# Altium project DE-290817.PrjPcb
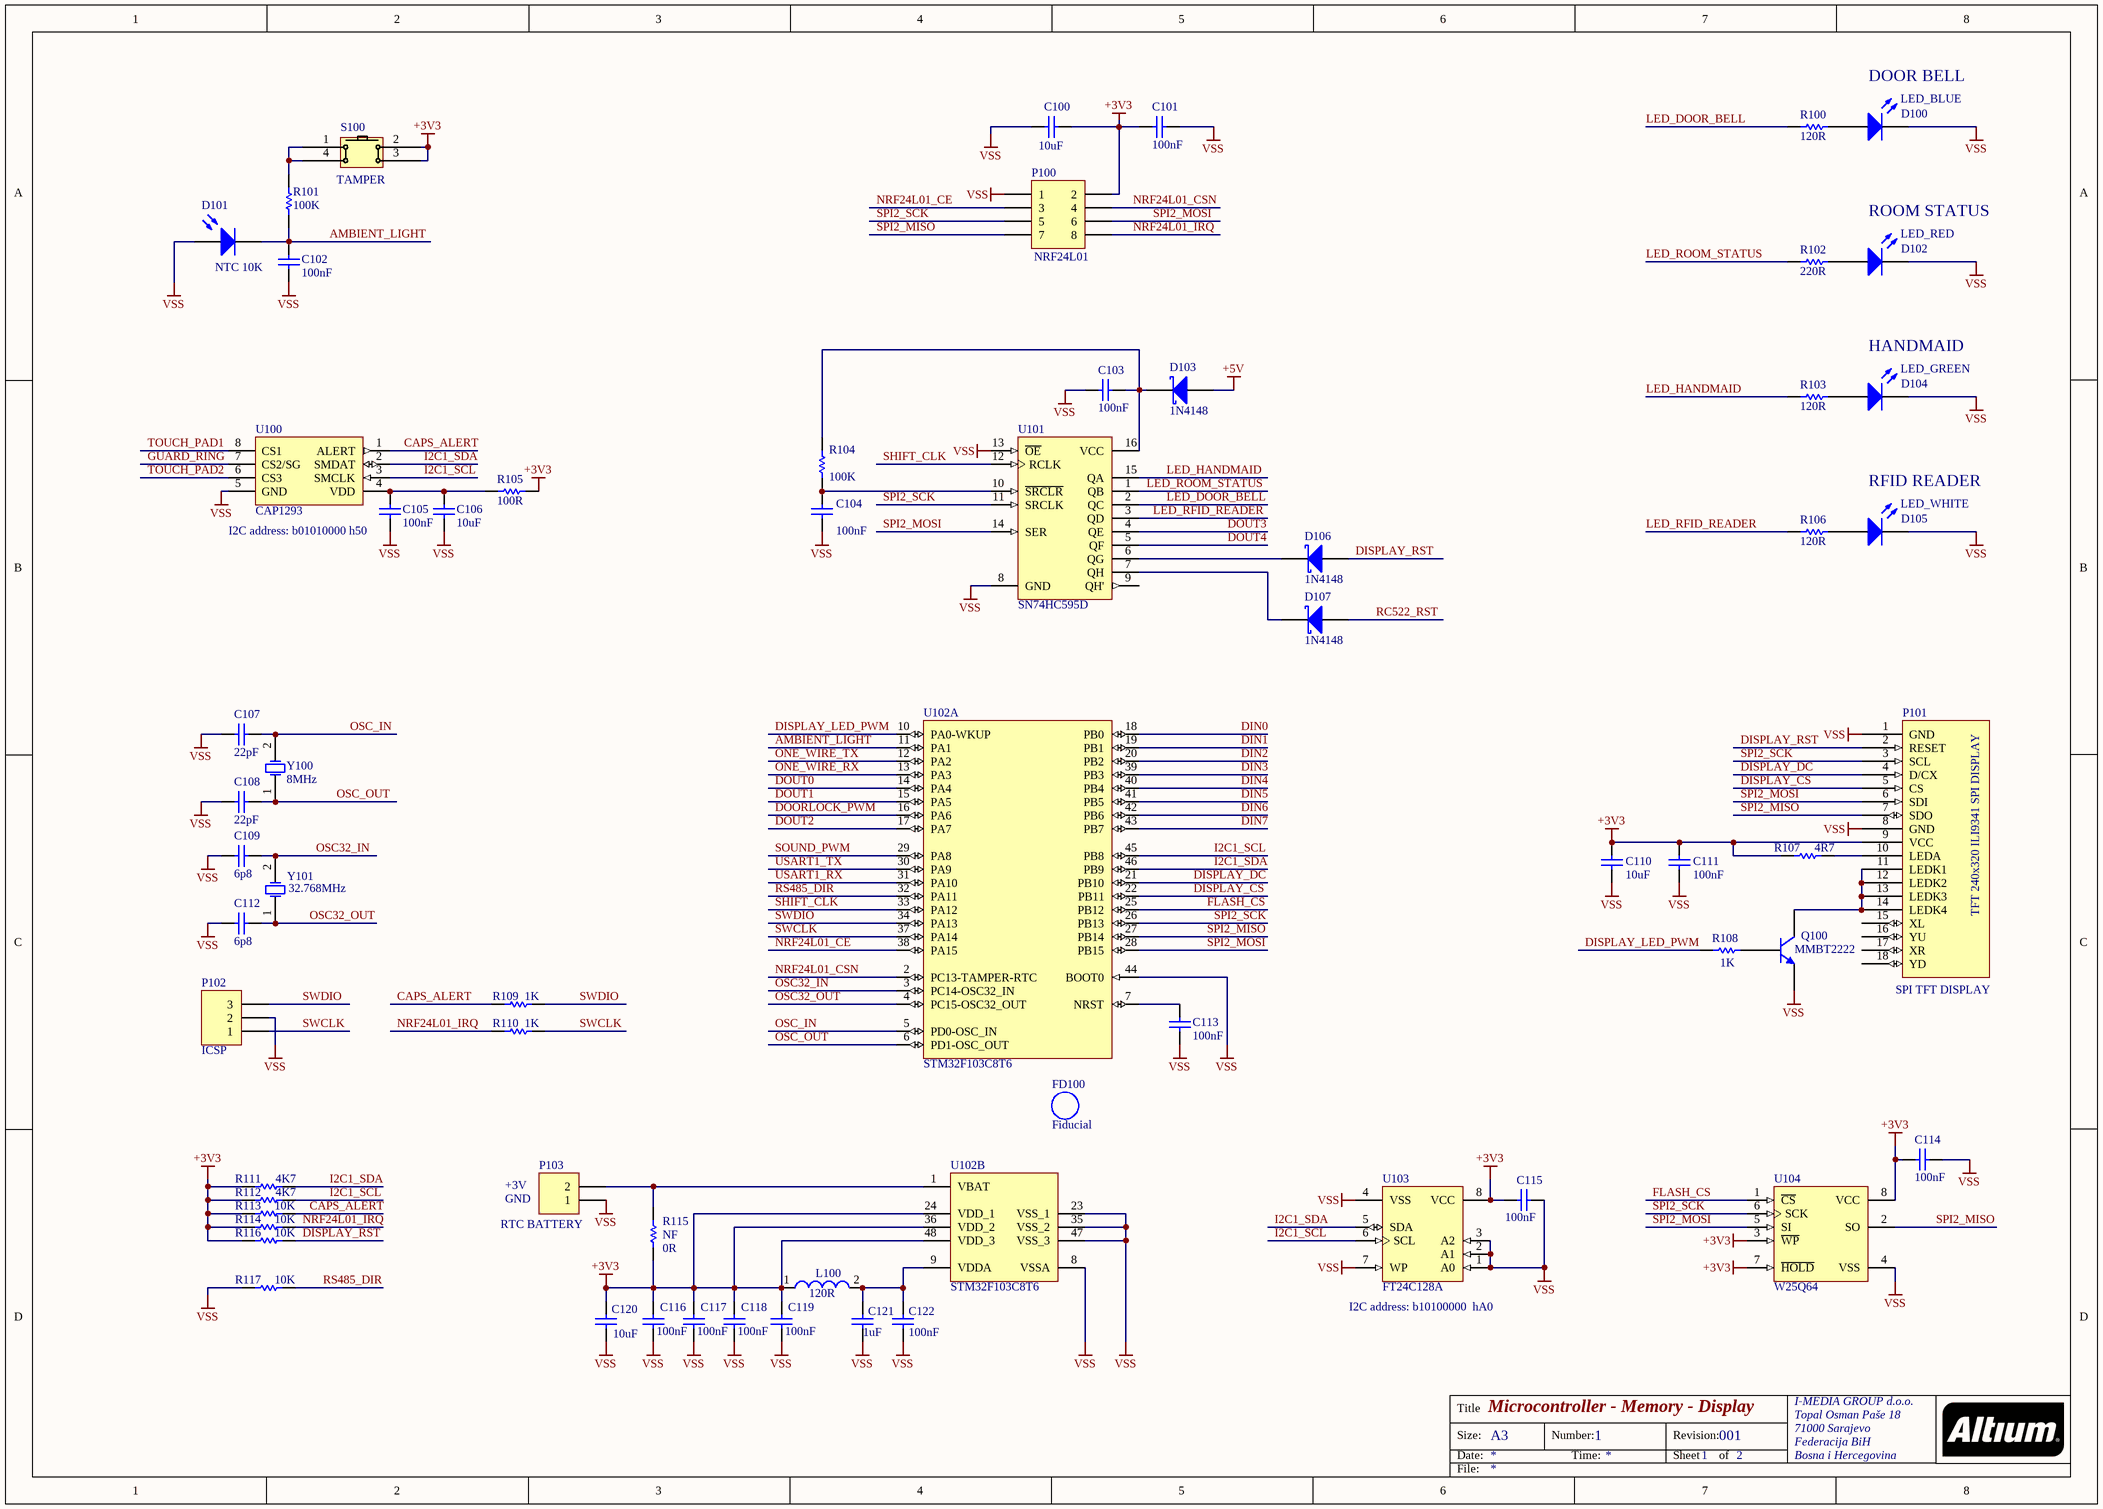
[diagram p0: DE-290817_01.SchDoc]
3 sheets, 176 parts. Net scope: global (net labels, ports and power ports of the same name join across sheets).
Board file: DE-290817.PcbDoc
Sheets:
  DE-290817_01.SchDoc
  DE-290817_02.SchDoc
  DE-290817_03.SchDoc

## Sheet DE-290817_01.SchDoc: Microcontroller - Memory - Display
size A3; Author: eldar6776@hotmail.com; DrawnBy: Eldar Dedić; Organization: I-MEDIA GROUP d.o.o.; Address1: Topal Osman Paše 18; Address2: 71000 Sarajevo; Address3: Federacija BiH; Address4: Bosna i Hercegovina; DocumentNumber: 1; Revision: 001; SheetNumber: 1; SheetTotal: 2; DocumentName: DE-290817; ProjectName: Hotel Room Access Controller Unit

### Parts
C100  10uF  [0805]
C101  100nF  [0603]
C102  100nF  [0603]
C103  100nF  [0603]
C104  100nF  [0603]
C105  100nF  [0603]
C106  10uF  [0805]
C107  22pF  [0603]
C108  22pF  [0603]
C109  6p8  [0603]
C110  10uF  [0805]
C111  100nF  [0603]
C112  6p8  [0603]
C113  100nF  [0603]
C114  100nF  [0603]
C115  100nF  [0603]
C116  100nF  [0603]
C117  100nF  [0603]
C118  100nF  [0603]
C119  100nF  [0603]
C120  10uF  [0805]
C121  1uF  [0603]
C122  100nF  [0603]
D100  LED_BLUE  [1.6X0.8X0.8]
D101  NTC 10K  [PIN2]
D102  LED_RED  [1.6X0.8X0.8]
D103  1N4148  [SOD323]
D104  LED_GREEN  [1.6X0.8X0.8]
D105  LED_WHITE  [1.6X0.8X0.8]
D106  1N4148  [SOD323]
D107  1N4148  [SOD323]
FD100  Fiducial  [Fiducial]  (no BOM)
L100  120R  [SMD-0805]
P100  NRF24L01  [HDR2X4]
P101  SPI TFT DISPLAY  [DISPLAY CON]
P102  ICSP  [ICSP]
P103  RTC BATTERY  [HDR1X2]
Q100  MMBT2222  [SOT23_N]
R100  120R  [ERA-0603]
R101  100K  [ERA-0603]
R102  220R  [ERA-0603]
R103  120R  [ERA-0603]
R104  100K  [ERA-0603]
R105  100R  [ERA-0603]
R106  120R  [ERA-0603]
R107  4R7  [ERA-0603]
R108  1K  [ERA-0603]
R109  1K  [ERA-0603]
R110  1K  [ERA-0603]
R111  4K7  [ERA-0603]
R112  4K7  [ERA-0603]
R113  10K  [ERA-0603]
R114  10K  [ERA-0603]
R115  NF  value 0R  [ERA-0603]
R116  10K  [ERA-0603]
R117  10K  [ERA-0603]
S100  TAMPER  [TACTILE_SWITCH]
U100  CAP1293  [SOP8]
U101  SN74HC595D  [D016_N]
U102  STM32F103C8T6  [STM-LQFP48_N]  (parts A,B of 2)
U103  FT24C128A  [SOIC-SN8_N]
U104  W25Q64  [SOIJ-SM8_N]
Y100  8MHz  [HC49/4H_SMX]
Y101  32.768MHz  [R26]

### Nets
+3V3: C100.1 C101.1 C110.2 C111.1 C114.1 C115.1 C116.2 C117.2 C118.2 C119.2 C120.2 L100.1 P100.2 P101.9(VCC) R105.2 R107.1 R111.2 R112.2 R113.2 R114.2 R115.2 R116.2 S100.2 S100.3 U102.24(VDD_1) U102.36(VDD_2) U102.48(VDD_3) U103.8(VCC) U104.3(~{WP}) U104.7(~{HOLD}) U104.8(VCC)
+5V: D103.2(A)
VSS: C100.2 C101.2 C102.1 C103.2 C104.1 C105.2 C106.1 C107.2 C108.2 C109.2 C110.1 C111.2 C112.2 C113.2 C114.2 C115.2 C116.1 C117.1 C118.1 C119.1 C120.1 C121.1 C122.1 D100.2(K) D101.1(A) D102.2(K) D104.2(K) D105.2(K) P100.1 P101.1(GND) P101.8(GND) P102.2 P103.1 Q100.2(E) R117.2 U100.5(GND) U101.8(GND) U101.13(~{OE}) U102.8(VSSA) U102.23(VSS_1) U102.35(VSS_2) U102.44(BOOT0) U102.47(VSS_3) U103.1(A0) U103.2(A1) U103.3(A2) U103.4(VSS) U103.7(WP) U104.4(VSS)
AMBIENT_LIGHT: C102.2 D101.2(K) R101.2 U102.11(PA1)
CAPS_ALERT: R109.2 R113.1 U100.1(ALERT)
DIN0: U102.18(PB0)
DIN1: U102.19(PB1)
DIN2: U102.20(PB2)
DIN3: U102.39(PB3)
DIN4: U102.40(PB4)
DIN5: U102.41(PB5)
DIN6: U102.42(PB6)
DIN7: U102.43(PB7)
DISPLAY_CS: P101.5(CS) U102.22(PB11)
DISPLAY_DC: P101.4(D/CX) U102.21(PB10)
DISPLAY_LED_PWM: R108.1 U102.10(PA0-WKUP)
DISPLAY_RST: D106.2(A) P101.2(RESET) R116.1
DOORLOCK_PWM: U102.16(PA6)
DOUT0: U102.14(PA4)
DOUT1: U102.15(PA5)
DOUT2: U102.17(PA7)
DOUT3: U101.4(QE)
DOUT4: U101.5(QF)
FLASH_CS: U102.25(PB12) U104.1(~{CS})
GUARD_RING: U100.7(CS2/SG)
I2C1_SCL: R112.1 U100.3(SMCLK) U102.45(PB8) U103.6(SCL)
I2C1_SDA: R111.1 U100.2(SMDAT) U102.46(PB9) U103.5(SDA)
LED_DOOR_BELL: R100.2 U101.2(QC)
LED_HANDMAID: R103.2 U101.15(QA)
LED_RFID_READER: R106.2 U101.3(QD)
LED_ROOM_STATUS: R102.2 U101.1(QB)
NRF24L01_CE: P100.3 U102.38(PA15)
NRF24L01_CSN: P100.4 U102.2(PC13-TAMPER-RTC)
NRF24L01_IRQ: P100.8 R110.2 R114.1
ONE_WIRE_RX: U102.13(PA3)
ONE_WIRE_TX: U102.12(PA2)
OSC32_IN: C109.1 U102.3(PC14-OSC32_IN) Y101.2(OSC2)
OSC32_OUT: C112.1 U102.4(PC15-OSC32_OUT) Y101.1(OSC1)
OSC_IN: C107.1 U102.5(PD0-OSC_IN) Y100.2(OSC2)
OSC_OUT: C108.1 U102.6(PD1-OSC_OUT) Y100.1(OSC1)
RC522_RST: D107.2(A)
RS485_DIR: R117.1 U102.32(PA11)
SHIFT_CLK: U101.12(RCLK) U102.33(PA12)
SOUND_PWM: U102.29(PA8)
SPI2_MISO: P100.7 P101.7(SDO) U102.27(PB14) U104.2(SO)
SPI2_MOSI: P100.6 P101.6(SDI) U101.14(SER) U102.28(PB15) U104.5(SI)
SPI2_SCK: P100.5 P101.3(SCL) U101.11(SRCLK) U102.26(PB13) U104.6(SCK)
SWCLK: P102.1 R110.1 U102.37(PA14)
SWDIO: P102.3 R109.1 U102.34(PA13)
TOUCH_PAD1: U100.8(CS1)
TOUCH_PAD2: U100.6(CS3)
USART1_RX: U102.31(PA10)
USART1_TX: U102.30(PA9)
NetC103_1: C103.1 D103.1(K) R104.1 U101.16(VCC)
NetC104_2: C104.2 R104.2 U101.10(~{SRCLR})
NetC105_1: C105.1 C106.2 R105.1 U100.4(VDD)
NetC113_1: C113.1 U102.7(NRST)
NetC121_2: C121.2 C122.2 L100.2 U102.9(VDDA)
NetD100_1: D100.1(A) R100.1
NetD102_1: D102.1(A) R102.1
NetD104_1: D104.1(A) R103.1
NetD105_1: D105.1(A) R106.1
NetD106_1: D106.1(K) U101.6(QG)
NetD107_1: D107.1(K) U101.7(QH)
NetP101_10: P101.10(LEDA) R107.2
NetP101_11: P101.11(LEDK1) P101.12(LEDK2) P101.13(LEDK3) P101.14(LEDK4) Q100.3(C)
NetP103_2: P103.2 R115.1 U102.1(VBAT)
NetQ100_1: Q100.1(B) R108.2
NetR101_1: R101.1 S100.1 S100.4

Not connected (* = marked no-connect by the designer): P101 15(XL) 16(YU) 17(XR) 18(YD); U101 9(QH')

### Notes on the sheet
- DOOR BELL
- ROOM STATUS
- HANDMAID
- RFID READER
- (near C105) I2C address: b01010000 h50
- +3V
- GND
- (near U103) I2C address: b10100000  hA0
- Title
- Size:
- Date:
- A3
- Number:
- Time:
- Revision:
- Sheet
- of
- File:
- (in symbol DISPLAY CONNECTOR) TFT 240x320 ILI9341 SPI DISPLAY

### Library data of the parts
C100 C106 C110 C120 = C0805: Ceramic Chip Capacitor - Standard; Note: Footprint corresponds to dimensions for bulk cassette packaging. This case size has tightened tolerances.; Published: 17-Jul-2002; LatestRevisionDate: 19-Mar-2004; LatestRevisionNote: Silkscreen size reduced.; DatasheetDocument: Mar-2001; PackageDocument: Mar-2001; PackageReference: 0805; Publisher: Altium Limited; Code_JEITA: 0805; Code_IPC: 2012[0805]; ComponentLink1Description: Manufacturer Link; ComponentLink1URL: http://www.kemet.com/; ComponentLink2Description: Datasheet; ComponentLink2URL: http://www.kemet.com/kemet/web/homepage/kechome.nsf/vapubfilesname/F3102TA.pdf/$file/F3102TA.pdf; Value: 10uF
C101 C102 C104 C105 C107-C109 C111-C119 C121 C122 = C0603: Ceramic Chip Capacitor - Standard; Note: Footprint corresponds to dimensions for bulk cassette packaging. This case size has tightened tolerances.; Published: 17-Jul-2002; LatestRevisionDate: 19-Mar-2004; LatestRevisionNote: Silkscreen size reduced.; DatasheetDocument: Mar-2001; PackageDocument: Mar-2001; PackageReference: 0603; Publisher: Altium Limited; Code_JEITA: 0603; Code_IPC: 1608 [0603]; ComponentLink1Description: Manufacturer Link; ComponentLink1URL: http://www.kemet.com/; ComponentLink2Description: Datasheet; ComponentLink2URL: http://www.kemet.com/kemet/web/homepage/kechome.nsf/vapubfilesname/F3102TA.pdf/$file/F3102TA.pdf
  C104 C105 C111 C113 C115 C122: Value: 100nF
  C121: Value: 1uF
C103 = C0603: Ceramic Chip Capacitor - Standard; Note: Footprint corresponds to dimensions for bulk cassette packaging. This case size has tightened tolerances.; Value: 1uF; Published: 17-Jul-2002; LatestRevisionDate: 19-Mar-2004; LatestRevisionNote: Silkscreen size reduced.; DatasheetDocument: Mar-2001; PackageDocument: Mar-2001; PackageReference: 0603; Publisher: Altium Limited; Code_JEITA: 0603; Code_IPC: 1608 [0603]; ComponentLink1Description: Manufacturer Link; ComponentLink1URL: http://www.kemet.com/; ComponentLink2Description: Datasheet; ComponentLink2URL: http://www.kemet.com/kemet/web/homepage/kechome.nsf/vapubfilesname/F3102TA.pdf/$file/F3102TA.pdf
D100 D102 D104 D105 = HSMZ-C190: High Performance Chip LED, Red; LuminousIntensity: 40mcd (Minimum).; PCB_Layout: Complies with manufacturer's recommendation.; Published: 11-Dec-2002; DatasheetDocument: 11-Mar-2002; PackageDocument: 11-Mar-2002; PackageReference: 1.6X0.8X0.8; Publisher: Altium Limited; LED_Colour: Red; ComponentLink1Description: Manufacturer Link; ComponentLink1URL: http://www.agilent.com/; ComponentLink2Description: Datasheet; ComponentLink2URL: http://cp.literature.agilent.com/litweb/pdf/5988-5891EN.pdf
D101 = Photo Sen: Photosensitive Diode; Published: 24-Mar-1999; LatestRevisionDate: 17-Jul-2002; LatestRevisionNote: Re-released for DXP Platform.; PackageReference: PIN2; Publisher: Altium Limited
D103 D106 D107 = 1PS76SB10: Schottky Barrier Diode; Published: 17-Sep-2003; LatestRevisionDate: 19-Mar-2004; LatestRevisionNote: Silkscreen size reduced.; DatasheetVersion: 14-Oct-1996; PackageVersion: May-1999; PackageReference: SOD323; Publisher: Altium Limited; PackageDescription: SOD-323/SC-76; 2 Leads; Body 1.7 x 1.3 mm, (LxW); ComponentLink1Description: Manufacturer Link; ComponentLink1URL: http://www.semiconductors.philips.com/; ComponentLink2Description: Datasheet; ComponentLink2URL: http://www.semiconductors.philips.com/acrobat/datasheets/1PS76SB10_2.pdf
FD100 = Fiduchial: Fiduchial mark
L100 = 74279202: SMD EMI Suppression Ferrite Bead WE-CBF, Z = 120 Ohm; Impedance: 120 Ohm; DatasheetVersion: Dec-2005; PackageVersion: 2005; PackageReference: SMD-0805; PackageDescription: Chip Inductor, 2-Leads, Body 2.0 x 1.2 mm; ComponentLink1Description: Manufacturer URL; ComponentLink1URL: http://www.we-online.com; ComponentLink2Description: Datasheet; ComponentLink2URL: http://www.we-online.de/katalog/media/pdf/74279202.pdf
P100 = Header 4X2: Header, 4-Pin, Dual row; LatestRevisionDate: 17-Jul-2002; LatestRevisionNote: Re-released for DXP Platform.; Publisher: Altium Limited
P101 = DISPLAY CONNECTOR: DISPLAY ILI9341 240x320  CONNECTOR
P102 = ICSP: ICSP connection pads
P103 = Header 2: Header, 2-Pin; LatestRevisionDate: 17-Jul-2002; LatestRevisionNote: Re-released for DXP Platform.; Publisher: Altium Limited
Q100 = BC817: NPN General-purpose Transistor; Published: 17-Sep-2003; LatestRevisionDate: 12-Dec-2006; LatestRevisionNote: IPC-7351 Footprint Added.; DatasheetVersion: Jun-1999; PackageVersion: May-1999; PackageReference: SOT23; Publisher: Altium Limited; PackageDescription: 3-Pin SOT-23 Package 0.95 mm Pitch, 2.3 mm Lead Span; ComponentLink1Description: Manufacturer Link; ComponentLink1URL: http://www.semiconductors.philips.com/; ComponentLink2Description: Datasheet; ComponentLink2URL: http://www.semiconductors.philips.com/acrobat/datasheets/BC817_BC817W_BC337_5.pdf
R100-R117 = ERAV: Metal Film Thermosensitive Chip Resistor, 0.56 Ohm to 10k Ohm Range, 5% Tolerance, 0603 Size, 0.063 W; Note: If flow soldering, adjust pad width of PCB Footprint to 0.7 - 0.8 times the width of the resistor.; Published: 17-Dec-2003; LatestRevisionDate: 19-Mar-2004; LatestRevisionNote: Silkscreen size reduced.; PackageDocument: Mar-2003; PackageReference: ERA-0603; Publisher: Altium Limited; Code_IPC: 1608 [0603]; ComponentLink1Description: Manufacturer Link; ComponentLink1URL: http://www.panasonic.com/industrial/components/resistive_products.htm; ComponentLink2Description: Datasheet; ComponentLink2URL: http://www.panasonic.com/industrial/components/pdf/AOF0000CE1.pdf
  R104: Value: 100K
  R105: Value: 100R
S100 = TACKTILE_SWITCH
U100 = CAP1293: 3-Channel Capacitive Touch Sensor with Proximity Detection & Signal Guard
U101 = SN74HC595D: 8-Bit Shift Register with 3-State Output Registers; Published: 8-Jun-2000; LatestRevisionDate: 13-Apr-2006; LatestRevisionNote: IPC-7351 Footprint Added.; DatasheetVersion: May-1997; PackageVersion: Jan-1998; PackageReference: D016; Publisher: Altium Limited; PackageDescription: 16-Pin Small Outline Integrated Circuit 1.27 mm Pitch; Code_IPC: SOIC127P600-16; ComponentLink1Description: Manufacturer Link; ComponentLink1URL: http://www.ti.com/; ComponentLink2Description: Datasheet; ComponentLink2URL: http://www-s.ti.com/sc/ds/sn74hc595.pdf
U102 = STM32F103C8T6: ARM Cortex-M3 32-bit MCU, 64 KB Flash, 20 KB Internal RAM, 37 I/Os, 48-pin LQFP, -40 to 85 degC, Tray; A/D Converter: 2x12-bit (10 Channel); FLASH Size (Prog) (kB): 64; I/Os (High Current): 37; Internal RAM Size (kB): 20; Operating Frequency(F) (Processor speed) (MHz): 72; Supply Voltage(Vcc) min (V): 2; DatasheetVersion: Rev. 16; PackageVersion: Rev. 6, 06/2013; PackageReference: LQFP48; PackageDescription: 48-Pin Low Profile Quad Flat Package, 7 x 7 mm Body, 0.5 mm Pitch; Supplier 1: Digi-Key; Supplier Part Number 1: 497-6063-ND; Supplier 2: Farnell; Supplier Part Number 2: 1447637; Supplier 3: Newark; Supplier Part Number 3: 59M2182; Supplier 4: Newark; Supplier Part Number 4: 57P1222; Supplier 5: Mouser; Supplier Part Number 5: 511-STM32F103C8T6; Core: ARM Cortex-M3; Packing: Tray; Mounting Technology: Surface Mount; PartNumber: STM32F103C8T6; ComponentLink1Description: Manufacturer URL; ComponentLink1URL: http://www.st.com/web/en/home.html; ComponentLink2Description: Datasheet; ComponentLink2URL: http://www.st.com/st-web-ui/static/active/en/resource/technical/document/datasheet/CD00161566.pdf; ComponentLink3Description: Package Specification; ComponentLink3URL: http://www.st.com/st-web-ui/static/active/en/resource/technical/document/datasheet/DM00058181.pdf
U103 = 24AA64/SN: 64Kbit, 400kHz, 1.7V, I2C Serial EEPROM, 8-Pin SOIC 150mil, Commercial Temperature; Published: 29-Jan-2009; DatasheetVersion: revQ, Jun-2009; PackageVersion: revBB, Aug-2009; PackageReference: SOIC-SN8; Publisher: Altium Limited; PackageDescription: 8-Lead Plastic Small Outline (SN) - Narrow, 3.90mm Body [SOIC]; Supplier 1: Digi-Key; Supplier Part Number 1: 24AA64/SN-ND; Code_JEDEC: MS-012; Code_IPC: SOIC127P600-8; ComponentLink1Description: Datasheet; ComponentLink1URL: http://ww1.microchip.com/downloads/en/DeviceDoc/21189Q.pdf; ComponentLink2Description: Packaging Specification; ComponentLink2URL: http://www.microchip.com/stellent/groups/techpub_sg/documents/packagingspec/en012702.pdf; ComponentLink3Description: Microchip.com Home; ComponentLink3URL: http://www.microchip.com/
U104 = 25LC640A-I/SN: 64K SPI Bus Serial EEPROM, 8-Pin SOIC, Industrial Temperature; Published: 29-Jan-2009; LatestRevisionDate: 02-Dec-2009; LatestRevisionNote: Updated to datasheet revision D, Jan-2008; DatasheetVersion: revD, Oct-2008; PackageVersion: revBB, Aug-2009; PackageReference: SOIC-SN8; Publisher: Altium Limited; PackageDescription: 8-Lead Plastic Small Outline (SN) - Narrow, 3.90mm Body [SOIC]; Supplier 1: Digi-Key; Supplier Part Number 1: 25LC640A-I/SN-ND; Supplier 2: Farnell; Supplier Part Number 2: 1556155; Code_JEDEC: MS-012; Code_IPC: SOIC127P600-8; ComponentLink1Description: Datasheet; ComponentLink1URL: http://ww1.microchip.com/downloads/en/DeviceDoc/21830D.pdf; ComponentLink2Description: Packaging Specification; ComponentLink2URL: http://www.microchip.com/stellent/groups/techpub_sg/documents/packagingspec/en012702.pdf; ComponentLink3Description: Microchip.com Home; ComponentLink3URL: http://www.microchip.com/
Y100 = HC49/4H_SMX: Surface Mount Quartz Crystal; Note: PCB layout complies with manufacturer's recommendation.; Published: 17-Jul-2002; DatasheetDocument: 18-Oct-1999; PackageDocument: 18-Oct-1999; PackageReference: HC49/4H_SMX; Publisher: Altium Limited; ComponentLink1Description: Manufacturer Link; ComponentLink1URL: http://www.cmac.com/mt/; ComponentLink2Description: Datasheet; ComponentLink2URL: http://www.cmac.com/mt/databook/crystals/smd/hc49_4h_smx.pdf
Y101 = R26-32.768: Tuning Fork Crystal Unit; Published: 8-Jun-2000; LatestRevisionDate: 17-Jul-2002; LatestRevisionNote: Re-released for DXP Platform.; DatasheetDocument: 28-Sep-1998; PackageReference: R26; Publisher: Altium Limited; ComponentLink1Description: Manufacturer Link; ComponentLink1URL: http://www.raltron.com/products/microcrystals/default.asp; ComponentLink2Description: Datasheet; ComponentLink2URL: http://www.raltron.com/products/pdfspecs/crystal_r38_26_145.pdf

## Sheet DE-290817_02.SchDoc: Digital I/O - Power - Com
size A3; Author: eldar6776@hotmail.com; DrawnBy: Eldar Dedić; Organization: I-MEDIA GROUP d.o.o.; Address1: Topal Osman Paše 18; Address2: 71000 Sarajevo; Address3: Federacija BiH; Address4: Bosna i Hercegovina; DocumentNumber: 2; Revision: 001; SheetNumber: 2; SheetTotal: 2; DocumentName: DE-290817; ProjectName: Hotel Room Access Controller Unit
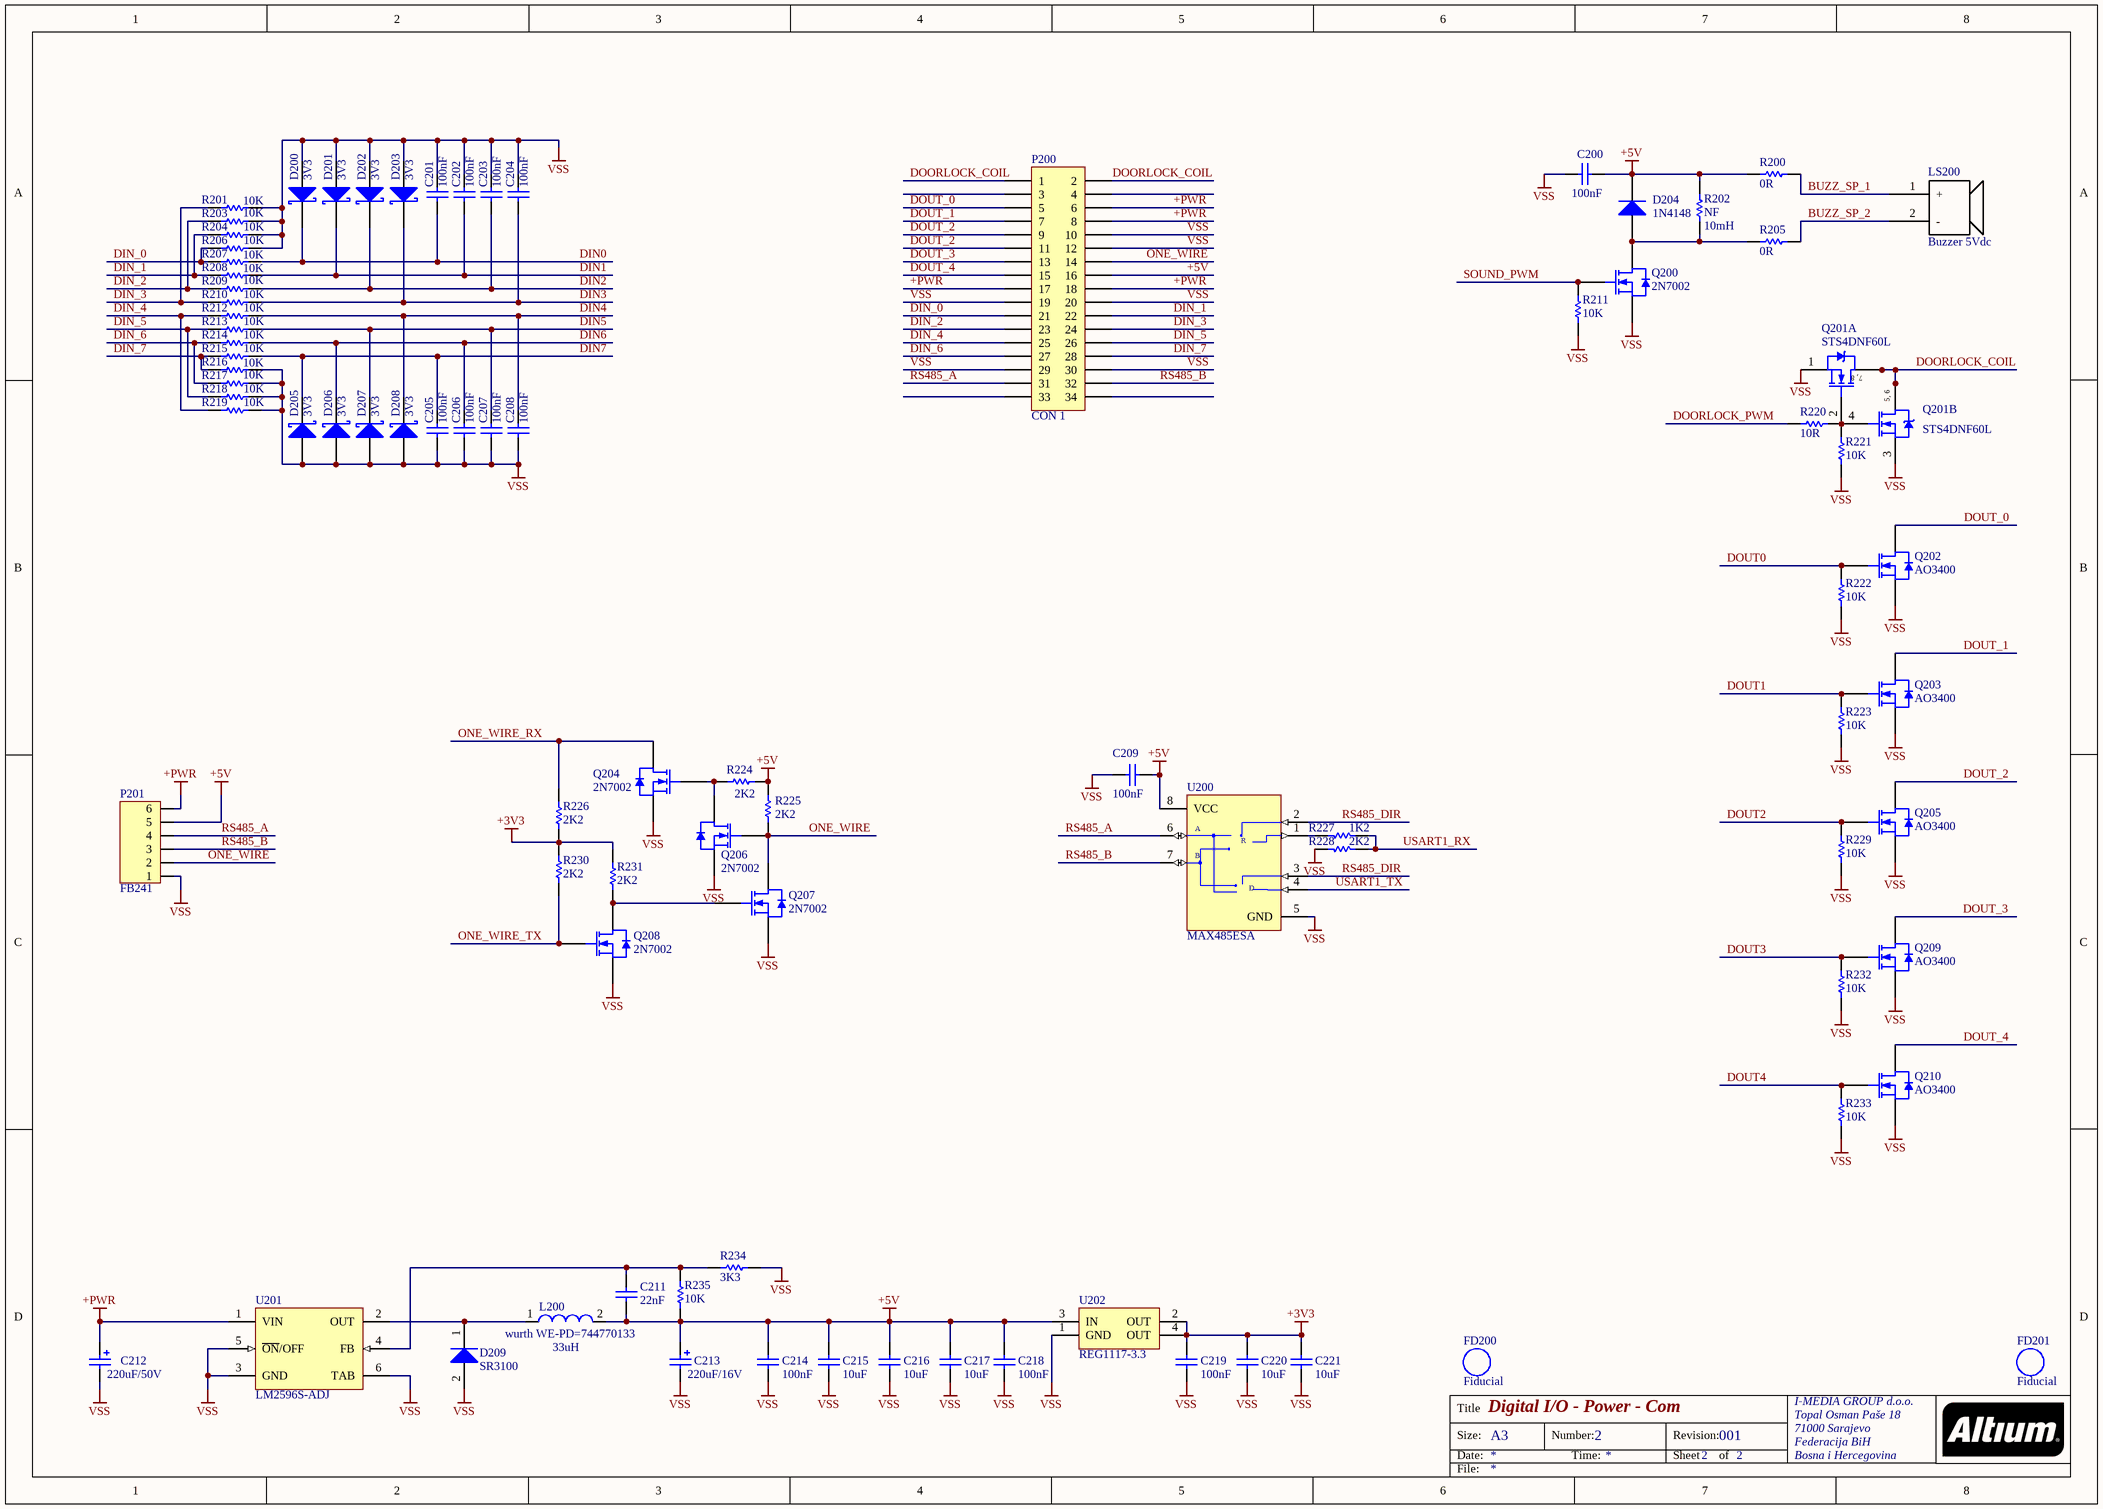
[diagram p1: DE-290817_02.SchDoc]

### Parts
C200  100nF  [0603]
C201  100nF  [0603]
C202  100nF  [0603]
C203  100nF  [0603]
C204  100nF  [0603]
C205  100nF  [0603]
C206  100nF  [0603]
C207  100nF  [0603]
C208  100nF  [0603]
C209  100nF  [0603]
C211  22nF  [0603]
C212  220uF/50V  [EEEHA1H101P]
C213  220uF/16V  [EEEHA1H101P]
C214  100nF  [0603]
C215  10uF  [0805]
C216  10uF  [0805]
C217  10uF  [0805]
C218  100nF  [0603]
C219  100nF  [0603]
C220  10uF  [0805]
C221  10uF  [0805]
D200  3V3  [SOD323]
D201  3V3  [SOD323]
D202  3V3  [SOD323]
D203  3V3  [SOD323]
D204  1N4148  [SOD323]
D205  3V3  [SOD323]
D206  3V3  [SOD323]
D207  3V3  [SOD323]
D208  3V3  [SOD323]
D209  SR3100  [ONSC-SMA-2-403D-02_C_V]
FD200  Fiducial  [Fiducial]  (no BOM)
FD201  Fiducial  [Fiducial]  (no BOM)
L200  wurth WE-PD=744770133  value 33uH  [WE-PD-XL]
LS200  Buzzer 5Vdc  [BUZZER]
P200  CON 1  [HDR2X17]
P201  FB241  [FB241_6]
Q200  2N7002  [SOT23_N]
Q201  STS4DNF60L  [ONSC-SOIC-8-751-07_V]  (parts A,B of 2)
Q202  AO3400  [SOT23_N]
Q203  AO3400  [SOT23_N]
Q204  2N7002  [SOT23_N]
Q205  AO3400  [SOT23_N]
Q206  2N7002  [SOT23_N]
Q207  2N7002  [SOT23_N]
Q208  2N7002  [SOT23_N]
Q209  AO3400  [SOT23_N]
Q210  AO3400  [SOT23_N]
R200  0R  [ERA-0603]
R201  10K  [ERA-0603]
R202  NF  value 10mH  [RD3.2x1.7]
R203  10K  [ERA-0603]
R204  10K  [ERA-0603]
R205  0R  [ERA-0603]
R206  10K  [ERA-0603]
R207  10K  [ERA-0603]
R208  10K  [ERA-0603]
R209  10K  [ERA-0603]
R210  10K  [ERA-0603]
R211  10K  [ERA-0603]
R212  10K  [ERA-0603]
R213  10K  [ERA-0603]
R214  10K  [ERA-0603]
R215  10K  [ERA-0603]
R216  10K  [ERA-0603]
R217  10K  [ERA-0603]
R218  10K  [ERA-0603]
R219  10K  [ERA-0603]
R220  10R  [ERA-0603]
R221  10K  [ERA-0603]
R222  10K  [ERA-0603]
R223  10K  [ERA-0603]
R224  2K2  [ERA-0603]
R225  2K2  [ERA-0603]
R226  2K2  [ERA-0603]
R227  1K2  [ERA-0603]
R228  2K2  [ERA-0603]
R229  10K  [ERA-0603]
R230  2K2  [ERA-0603]
R231  2K2  [ERA-0603]
R232  10K  [ERA-0603]
R233  10K  [ERA-0603]
R234  3K3  [ERA-0603]
R235  10K  [ERA-0603]
U200  MAX485ESA  [NSO8_M]
U201  LM2596S-ADJ  [TS5B_N]
U202  REG1117-3.3  [ZZ311]

### Nets
+3V3: C219.2 C220.2 C221.2 R226.1 R230.2 R231.2 U202.2(OUT) U202.4(OUT)
+5V: C200.1 C209.2 C211.1 C213.1 C214.2 C215.2 C216.2 C217.2 C218.2 D204.1(K) L200.2 P200.16 P201.5 R200.2 R202.2 R224.1 R225.2 R235.2 U200.8(VCC) U202.3(IN)
+PWR: C212.1 P200.6 P200.8 P200.17 P200.18 P201.6 U201.1(VIN)
VSS: C200.2 C201.1 C202.1 C203.1 C204.1 C205.1 C206.1 C207.1 C208.1 C209.1 C212.2 C213.2 C214.1 C215.1 C216.1 C217.1 C218.1 C219.1 C220.1 C221.1 D200.2(A) D201.2(A) D202.2(A) D203.2(A) D205.2(A) D206.2(A) D207.2(A) D208.2(A) D209.2(A) P200.10 P200.12 P200.19 P200.20 P200.29 P200.30 P201.1 Q200.2(S) Q201.1(S1) Q201.3(S2) Q202.2(S) Q203.2(S) Q204.2(S) Q205.2(S) Q206.2(S) Q207.2(S) Q208.2(S) Q209.2(S) Q210.2(S) R201.2 R203.2 R204.2 R206.2 R211.1 R216.2 R217.2 R218.2 R219.2 R221.2 R222.1 R223.1 R228.2 R229.1 R232.1 R233.1 R234.2 U200.5(GND) U201.3(GND) U201.5(~{ON}/OFF) U201.6(TAB) U202.1(GND)
BUZZ_SP_1: LS200.1(+) R200.1
BUZZ_SP_2: LS200.2(-) R205.1
DIN0: C201.2 D200.1(K) R207.2
DIN1: C202.2 D201.1(K) R208.2
DIN2: C203.2 D202.1(K) R209.2
DIN3: C204.2 D203.1(K) R210.2
DIN4: C208.2 D208.1(K) R212.2
DIN5: C207.2 D207.1(K) R213.2
DIN6: C206.2 D206.1(K) R214.2
DIN7: C205.2 D205.1(K) R215.2
DIN_0: P200.21 R206.1 R207.1
DIN_1: P200.22 R204.1 R208.1
DIN_2: P200.23 R203.1 R209.1
DIN_3: P200.24 R201.1 R210.1
DIN_4: P200.25 R212.1 R219.1
DIN_5: P200.26 R213.1 R218.1
DIN_6: P200.27 R214.1 R217.1
DIN_7: P200.28 R215.1 R216.1
DOORLOCK_COIL: P200.1 P200.2 Q201.5(D2) Q201.6(D2) Q201.7(D1) Q201.8(D1)
DOORLOCK_PWM: R220.2
DOUT0: Q202.1(G) R222.2
DOUT1: Q203.1(G) R223.2
DOUT2: Q205.1(G) R229.2
DOUT3: Q209.1(G) R232.2
DOUT4: Q210.1(G) R233.2
DOUT_0: P200.5 Q202.3(D)
DOUT_1: P200.7 Q203.3(D)
DOUT_2: P200.9 P200.11 Q205.3(D)
DOUT_3: P200.13 Q209.3(D)
DOUT_4: P200.15 Q210.3(D)
ONE_WIRE: P200.14 P201.2 Q206.1(G) Q207.3(D) R225.1
ONE_WIRE_RX: Q204.3(D) R226.2
ONE_WIRE_TX: Q208.1(G) R230.1
RS485_A: P200.31 P201.4 U200.6(A)
RS485_B: P200.32 P201.3 U200.7(B)
RS485_DIR: U200.2(~{RE}) U200.3(DE)
SOUND_PWM: Q200.1(G) R211.2
USART1_RX: R227.2 R228.1
USART1_TX: U200.4(DI)
NetC211_2: C211.2 R234.1 R235.1 U201.4(FB)
NetD204_2: D204.2(A) Q200.3(D) R202.1 R205.2
NetD209_1: D209.1(K) L200.1 U201.2(OUT)
NetQ201_2: Q201.2(G1) Q201.4(G2) R220.1 R221.1
NetQ204_1: Q204.1(G) Q206.3(D) R224.2
NetQ207_1: Q207.1(G) Q208.3(D) R231.1
NetR227_1: R227.1 U200.1(RO)

Not connected (* = marked no-connect by the designer): P200 3 4 33 34

### Notes on the sheet
- Title
- Size:
- Date:
- A3
- Number:
- Time:
- Revision:
- Sheet
- of
- File:
- (in symbol MAX485ESA) R; D
- (in symbol NVMD6N04R2G, part A) 7, 8
- (in symbol NVMD6N04R2G, part B) 5, 6

### Library data of the parts
C200-C209 C211 C214 C218 C219 = C0603: as C101 on sheet DE-290817_01; Published: 17-Jul-2002; LatestRevisionDate: 19-Mar-2004; LatestRevisionNote: Silkscreen size reduced.; DatasheetDocument: Mar-2001; PackageDocument: Mar-2001; PackageReference: 0603; Publisher: Altium Limited; Code_JEITA: 0603; Code_IPC: 1608 [0603]; ComponentLink1Description: Manufacturer Link; ComponentLink1URL: http://www.kemet.com/; ComponentLink2Description: Datasheet; ComponentLink2URL: http://www.kemet.com/kemet/web/homepage/kechome.nsf/vapubfilesname/F3102TA.pdf/$file/F3102TA.pdf
  C200-C209 C214 C218 C219: Value: 100nF
  C211: Value: 22nF
C212 = EEEHA1H101P: Aluminum Electrolytic Capacitors (SMD Type); Value: 220uF/50V
C213 = EEEHA1C221P: Aluminum Electrolytic Capacitors (SMD Type); Value: 220uF/16V
C215-C217 C220 C221 = C0805: as C100 on sheet DE-290817_01; Published: 17-Jul-2002; LatestRevisionDate: 19-Mar-2004; LatestRevisionNote: Silkscreen size reduced.; DatasheetDocument: Mar-2001; PackageDocument: Mar-2001; PackageReference: 0805; Publisher: Altium Limited; Code_JEITA: 0805; Code_IPC: 2012[0805]; ComponentLink1Description: Manufacturer Link; ComponentLink1URL: http://www.kemet.com/; ComponentLink2Description: Datasheet; ComponentLink2URL: http://www.kemet.com/kemet/web/homepage/kechome.nsf/vapubfilesname/F3102TA.pdf/$file/F3102TA.pdf; Value: 10uF
D200-D203 D205-D208 = 1PS76SB10: Schottky Barrier Diode; Published: 17-Sep-2003; LatestRevisionDate: 19-Mar-2004; LatestRevisionNote: Silkscreen size reduced.; DatasheetVersion: 14-Oct-1996; PackageVersion: May-1999; PackageReference: SOD323; Publisher: Altium Limited; PackageDescription: SOD-323/SC-76; 2 Leads; Body 1.7 x 1.3 mm, (LxW); ComponentLink1Description: Manufacturer Link; ComponentLink1URL: http://www.semiconductors.philips.com/; ComponentLink2Description: Datasheet; ComponentLink2URL: http://www.semiconductors.philips.com/acrobat/datasheets/1PS76SB10_2.pdf
D204 = BAS321: General-purpose Diode; Published: 17-Sep-2003; LatestRevisionDate: 19-Mar-2004; LatestRevisionNote: Silkscreen size reduced.; DatasheetVersion: 9-Feb-1999; PackageVersion: May-1999; PackageReference: SOD323; Publisher: Altium Limited; PackageDescription: SOD-323/SC-76; 2 Leads; Body 1.7 x 1.3 mm, (LxW); ComponentLink1Description: Manufacturer Link; ComponentLink1URL: http://www.semiconductors.philips.com/; ComponentLink2Description: Datasheet; ComponentLink2URL: http://www.semiconductors.philips.com/acrobat/datasheets/BAS321_2.pdf; Value: 1N4148
D209 = MBRA320T3G: Schottky Power Rectifier, 2-Pin SMA, Pb-Free, Tape and Reel; Manufacturer: On Semiconductor; Configuration: Single; IFSM Max (A): 80; DatasheetVersion: Rev. 0; PackageVersion: Rev. C, 08/2005; PackageReference: SMA-2-403D-02_C; PackageDescription: 2-Pin Small Molded Package, J-Bend Lead, Body 4.315 x 2.605 mm; Supplier 1: Digi-Key; Supplier Part Number 1: MBRA320T3GOSTR-ND; Supplier 2: Digi-Key; Supplier Part Number 2: MBRA320T3GOSCT-ND; Supplier 3: Digi-Key; Supplier Part Number 3: MBRA320T3GOSDKR-ND; Supplier 4: Farnell; Supplier Part Number 4: 2101200; Supplier 5: Newark; Supplier Part Number 5: 95M6589; Supplier 6: Mouser; Supplier Part Number 6: 863-MBRA320T3G; Packing: Tape and Reel; RoHS: TRUE; Mounting Technology: Surface Mount; PartNumber: MBRA320T3G; ComponentLink1Description: Manufacturer URL; ComponentLink1URL: http://www.onsemi.com/; ComponentLink2Description: Datasheet; ComponentLink2URL: http://www.onsemi.cn/pub_link/Collateral/MBRA320-D.PDF; ComponentLink3Description: Package Specification; ComponentLink3URL: http://www.onsemi.com/pub_link/Collateral/MBRA320-D.PDF; Value: SR3100
FD200 FD201 = Fiduchial: Fiduchial mark
L200 = 744770133: SMD-Shielded Power Inductor WE-PD, L = 33 µH; Inductance: 33.0 µH; DatasheetVersion: ver 5, Oct-2004; PackageReference: WE-PD-XL; PackageDescription: SMD Inductor, 2-Leads, Body 12.0 x 12.0 mm; PartNumber: 744770133; ComponentLink1Description: Manufacturer URL; ComponentLink1URL: http://www.we-online.com; ComponentLink2Description: Datasheet; ComponentLink2URL: http://www.we-online.de/katalog/media/pdf/744770133.pdf
LS200 = BUZZER: 5Vdc PCB buzzer
P200 = Header 17X2: Header, 17-Pin, Dual row; LatestRevisionDate: 17-Jul-2002; LatestRevisionNote: Re-released for DXP Platform.; Publisher: Altium Limited
P201 = TERMINAL BLOCK 6: PCB MOUNT TERMINAL BLOCK 2.5MM PITCH
Q200 Q202 Q203 Q205 Q209 Q210 = 2N7002: N-channel Enhancement Mode Field-effect Transistor; Published: 17-Sep-2003; LatestRevisionDate: 12-Dec-2006; LatestRevisionNote: IPC-7351 Footprint Added.; DatasheetVersion: 27-Jul-2000; PackageVersion: May-1999; PackageReference: SOT23; Publisher: Altium Limited; PackageDescription: 3-Pin SOT-23 Package 0.95 mm Pitch, 2.3 mm Lead Span; ComponentLink1Description: Manufacturer Link; ComponentLink1URL: http://www.semiconductors.philips.com/; ComponentLink2Description: Datasheet; ComponentLink2URL: http://www.semiconductors.philips.com/acrobat/datasheets/2N7002_4.pdf
  Q200: Value: 2N7002
Q201 = NVMD6N04R2G: Power MOSFET, 40 V, 5.8 A, Dual N-Channel, 8-Pin SOIC, Pb-Free, Tape and Reel; Manufacturer: On Semiconductor; Channel Polarity: N Channel; Ciss Typ (pF): 723; Coss Typ (pF): 156; Crss Typ (pF): 53; ID Max (A): 5.8; Qrr Typ (nC): 20; V(BR)DSS Min (V): 40; VGS(th) Max (V): 3; DatasheetVersion: Rev. 2; PackageVersion: Rev. AK, 02/2011; PackageReference: SOIC-8-751-07; PackageDescription: 8-Pin Small Outline Integrated Circuit, Body 4.9 x 3.9 mm, Pitch 1.27 mm; Configuration: Dual; Package Type: SOIC-8; Packing: Tape and Reel; RoHS: Pb-Free; VGS Max (V): 20; Mounting Technology: Surface Mount; PartNumber: NVMD6N04R2G; ComponentLink1Description: Manufacturer URL; ComponentLink1URL: http://www.onsemi.com/; ComponentLink2Description: Datasheet; ComponentLink2URL: http://www.onsemi.com/pub_link/Collateral/NTMD6N04R2-D.PDF; ComponentLink3Description: Package Specification; ComponentLink3URL: http://www.onsemi.com/pub_link/Collateral/751-07.PDF
Q204 Q206-Q208 = BSS123: N-channel Enhancement Mode Vertical D-MOSFET; Published: 17-Sep-2003; LatestRevisionDate: 12-Dec-2006; LatestRevisionNote: IPC-7351 Footprint Added.; DatasheetVersion: Apr-1995; PackageVersion: May-1999; PackageReference: SOT23; Publisher: Altium Limited; PackageDescription: 3-Pin SOT-23 Package 0.95 mm Pitch, 2.3 mm Lead Span; ComponentLink1Description: Manufacturer Link; ComponentLink1URL: http://www.semiconductors.philips.com/; ComponentLink2Description: Datasheet; ComponentLink2URL: http://www.semiconductors.philips.com/acrobat/datasheets/BSS123_3.pdf
R200 R201 R203-R235 = ERAV: as R100 on sheet DE-290817_01; Published: 17-Dec-2003; LatestRevisionDate: 19-Mar-2004; LatestRevisionNote: Silkscreen size reduced.; PackageDocument: Mar-2003; PackageReference: ERA-0603; Publisher: Altium Limited; Code_IPC: 1608 [0603]; ComponentLink1Description: Manufacturer Link; ComponentLink1URL: http://www.panasonic.com/industrial/components/resistive_products.htm; ComponentLink2Description: Datasheet; ComponentLink2URL: http://www.panasonic.com/industrial/components/pdf/AOF0000CE1.pdf
  R200 R205: Value: 0R
  R211 R221-R223 R229 R232 R233: Value: 10K
  R220: Value: 10R
  R224 R225 R228 R230 R231: Value: 2K2
  R227: Value: 1K2
R202 = ERD6FC: Flame-Retardant Fuse Type Carbon Film Resistor, 4.7 Ohm to 1k Ohm Range, 2% and 5% Tolerance, 0.166 W; Published: 17-Dec-2003; PackageReference: RD3.2x1.7; Publisher: Altium Limited; ComponentLink1Description: Manufacturer Link; ComponentLink1URL: http://www.panasonic.com/industrial/components/resistive_products.htm; ComponentLink2Description: Datasheet; ComponentLink2URL: http://www.panasonic.com/industrial/components/pdf/AOB0000CE5.pdf
U200 = MAX485ESA: Low-Power, Slew-Rate-Limited RS-485/RS-422 Transceiver; Published: 16-Jan-2001; LatestRevisionDate: 13-Apr-2006; LatestRevisionNote: IPC-7351 Footprint Added.; DatasheetVersion: Feb-1996; PackageReference: NSO8; Publisher: Altium Limited; PackageDescription: 8-Pin Small Outline Integrated Circuit 1.27 mm Pitch; Code_JEDEC: MS-012-AA; Code_IPC: SOIC127P600-8; ComponentLink1Description: Manufacturer Link; ComponentLink1URL: http://www.maxim-ic.com/; ComponentLink2Description: Datasheet; ComponentLink2URL: http://pdfserv.maxim-ic.com/en/ds/MAX1487-MAX491.pdf
U201 = LM2596S-ADJ: SIMPLE SWITCHER® Power Converter 150 KHz 3A Step-Down Voltage Regulator, 5-pin TO-263; Manufacturer: National Semiconductor; PackageTopMarking: NSUZXYTTE#*LM2596S*-ADJ P+; PowerWise: N; High-Reliability: Y; DatasheetVersion: May-2002; PackageVersion: revD, Apr-2005; PackageReference: TS5B; PackageDescription: TO-263, Molded, .400 x .390 x .180in, 5 Lead, .067in Pitch, Surface Mount; PartNumber: LM2596S-ADJ; RoHS: N; PinCount: 5; CompType: Switcher; Code_JEDEC: MO-169-AB; ComponentLink1Description: Manufacturer URL; ComponentLink1URL: http://www.national.com/; ComponentLink2Description: LM2596 Datasheet; ComponentLink2URL: http://www.national.com/ds/LM/LM2596.pdf; ComponentLink3Description: LM2596 Web Page; ComponentLink3URL: http://www.national.com/pf/LM/LM2596.html; ComponentLink4Description: TS5B Package Page; ComponentLink4URL: http://www.national.com/packaging/folders/ts5b.html
U202 = REG1117-3.3: 800mA and 1A Low Dropout Positive Regulator 2.85V, 3.3V, 5V, and Adjustable; Published: 8-Jun-2000; LatestRevisionDate: 17-Jul-2002; LatestRevisionNote: Re-released for DXP Platform.; DatasheetVersion: Sep-1997; PackageVersion: revC; PackageReference: ZZ311; Publisher: Altium Limited; PackageDescription: SOT-223/SC-73; 4 Leads; Body 6.7 x 7.3 mm, inc. leads (LxW max); ComponentLink1Description: Manufacturer Link; ComponentLink1URL: http://www.ti.com/; ComponentLink2Description: Datasheet; ComponentLink2URL: http://www-s.ti.com/sc/ds/REG1117.pdf

## Sheet DE-290817_03.SchDoc: Mifare Reader Writer
size A4; Author: eldar6776@hotmail.com; DrawnBy: Eldar Dedić; Organization: I-MEDIA GROUP d.o.o.; Address1: Topal Osman Paše 18; Address2: 71000 Sarajevo; Address3: Federacija BiH; Address4: Bosna i Hercegovina; Revision: 001; DocumentName: DE-290817; ProjectName: Hotel Room Access Controller Unit
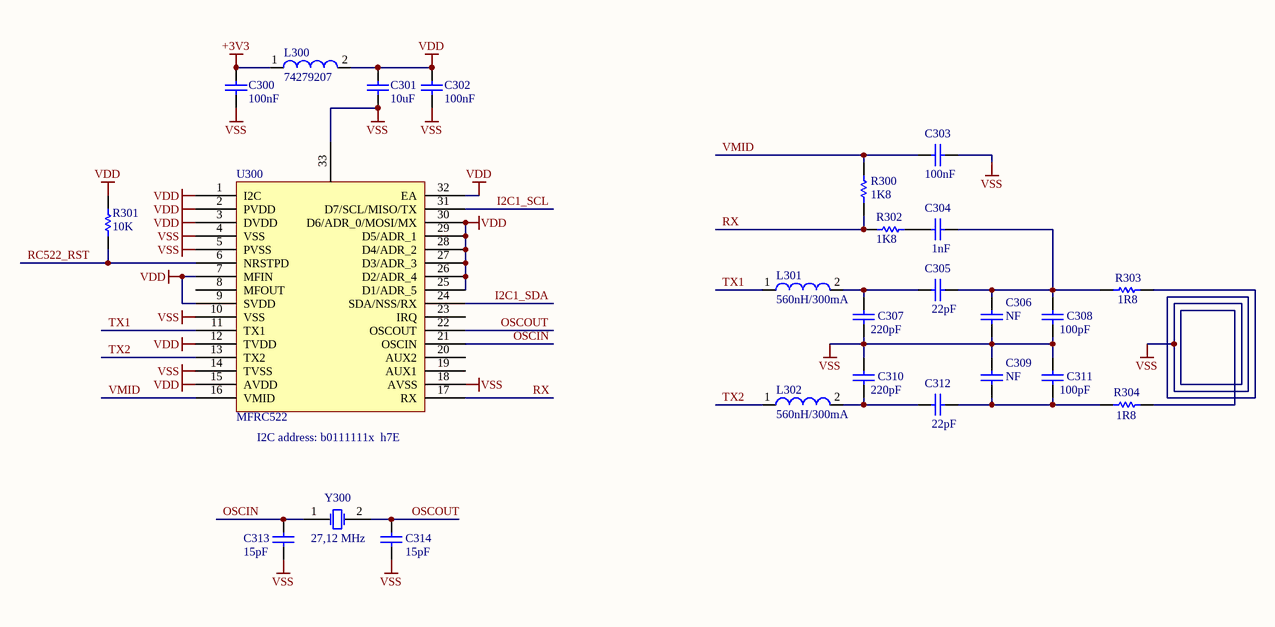
[diagram p2: DE-290817_03.SchDoc]

### Parts
C300  100nF  [0603]
C301  10uF  [0805]
C302  100nF  [0603]
C303  100nF  [0603]
C304  1nF  [0603]
C305  22pF  [0603]
C306  NF  [0603]
C307  220pF  [0603]
C308  100pF  [0603]
C309  NF  [0603]
C310  220pF  [0603]
C311  100pF  [0603]
C312  22pF  [0603]
C313  15pF  [0603]
C314  15pF  [0603]
L300  74279207  [SMD-0805]
L301  560nH/300mA  [SMD-0805]
L302  560nH/300mA  [SMD-0805]
R300  1K8  [3-0603]
R301  10K  [ERA-0603]
R302  1K8  [3-0603]
R303  1R8  [3-0603]
R304  1R8  [3-0603]
U300  MFRC522  [QFN32]
Y300  27,12 MHz  [HC49/4H_SMX]

### Nets
+3V3: C300.2 L300.1
VDD: C301.2 C302.2 L300.2 R301.2 U300.1(I2C) U300.2(PVDD) U300.3(DVDD) U300.7(MFIN) U300.9(SVDD) U300.12(TVDD) U300.15(AVDD) U300.25(D1/ADR_5) U300.26(D2/ADR_4) U300.27(D3/ADR_3) U300.28(D4/ADR_2) U300.29(D5/ADR_1) U300.30(D6/ADR_0/MOSI/MX) U300.32(EA)
VSS: C300.1 C301.1 C302.1 C303.1 C306.1 C307.1 C308.1 C309.2 C310.2 C311.2 C313.1 C314.1 R303.1 R304.1 U300.4(VSS) U300.5(PVSS) U300.10(VSS) U300.14(TVSS) U300.18(AVSS)
I2C1_SCL: U300.31(D7/SCL/MISO/TX)
I2C1_SDA: U300.24(SDA/NSS/RX)
OSCIN: C313.2 U300.21(OSCIN) Y300.1(OSC1)
OSCOUT: C314.2 U300.22(OSCOUT) Y300.2(OSC2)
RC522_RST: R301.1 U300.6(NRSTPD)
RX: R300.2 R302.2 U300.17(RX)
TX1: L301.1 U300.11(TX1)
TX2: L302.1 U300.13(TX2)
VMID: C303.2 R300.1 U300.16(VMID)
NetC304_1: C304.1 C305.1 C306.2 C308.2 R303.2
NetC304_2: C304.2 R302.1
NetC305_2: C305.2 C307.2 L301.2
NetC309_1: C309.1 C311.1 C312.1 R304.2
NetC310_1: C310.1 C312.2 L302.2

Not connected (* = marked no-connect by the designer): U300 8(MFOUT) 19(AUX1) 20(AUX2) 23(IRQ) 33(VSS)

### Notes on the sheet
- (near U300) I2C address: b0111111x  h7E
- Title
- Size:
- Date:
- A4
- Number:
- Time:
- Revision:
- Sheet
- of
- File:

### Library data of the parts
C300 C302-C314 = C0603: as C101 on sheet DE-290817_01; Published: 17-Jul-2002; LatestRevisionDate: 19-Mar-2004; LatestRevisionNote: Silkscreen size reduced.; DatasheetDocument: Mar-2001; PackageDocument: Mar-2001; PackageReference: 0603; Publisher: Altium Limited; Code_JEITA: 0603; Code_IPC: 1608 [0603]; ComponentLink1Description: Manufacturer Link; ComponentLink1URL: http://www.kemet.com/; ComponentLink2Description: Datasheet; ComponentLink2URL: http://www.kemet.com/kemet/web/homepage/kechome.nsf/vapubfilesname/F3102TA.pdf/$file/F3102TA.pdf
  C300 C302 C303: Value: 100nF
  C304: Value: 1nF
  C305 C312: Value: 22pF
  C306 C309: Value: NF
  C307 C310: Value: 220pF
  C308 C311: Value: 100pF
  C313 C314: Value: 15pF
C301 = C0805: as C100 on sheet DE-290817_01; Published: 17-Jul-2002; LatestRevisionDate: 19-Mar-2004; LatestRevisionNote: Silkscreen size reduced.; DatasheetDocument: Mar-2001; PackageDocument: Mar-2001; PackageReference: 0805; Publisher: Altium Limited; Code_JEITA: 0805; Code_IPC: 2012[0805]; ComponentLink1Description: Manufacturer Link; ComponentLink1URL: http://www.kemet.com/; ComponentLink2Description: Datasheet; ComponentLink2URL: http://www.kemet.com/kemet/web/homepage/kechome.nsf/vapubfilesname/F3102TA.pdf/$file/F3102TA.pdf; Value: 10uF
L300 = 74279207: SMD EMI Suppression Ferrite Bead WE-CBF, Z = 100 Ohm; Impedance: 100 Ohm; DatasheetVersion: Dec-2005; PackageReference: SMD-0805; PackageDescription: Chip Inductor, 2-Leads, Body 2.0 x 1.2 mm; PartNumber: 74279207; ComponentLink1Description: Manufacturer URL; ComponentLink1URL: http://www.we-online.com; ComponentLink2Description: Datasheet; ComponentLink2URL: http://www.we-online.de/katalog/media/pdf/74279207.pdf
L301 L302 = 74279207: SMD EMI Suppression Ferrite Bead WE-CBF, Z = 100 Ohm; Impedance: 100 Ohm; Value: 560nH; DatasheetVersion: Dec-2005; PackageReference: SMD-0805; PackageDescription: Chip Inductor, 2-Leads, Body 2.0 x 1.2 mm; PartNumber: 74279207; ComponentLink1Description: Manufacturer URL; ComponentLink1URL: http://www.we-online.com; ComponentLink2Description: Datasheet; ComponentLink2URL: http://www.we-online.de/katalog/media/pdf/74279207.pdf
R300 R302-R304 = ERJ3RS: Low Ohmic Value Thick Film Chip Resistor, 0.1 Ohm to 0.2 Ohm Range, 1%, 2% and 5% Tolerance, 0603 Size, 0.1 W; Published: 17-Dec-2003; LatestRevisionDate: 19-Mar-2004; LatestRevisionNote: Silkscreen size reduced.; PackageDocument: Mar-2003; PackageReference: 3-0603; Publisher: Altium Limited; Code_IPC: 1608 [0603]; ComponentLink1Description: Manufacturer Link; ComponentLink1URL: http://www.panasonic.com/industrial/components/resistive_products.htm; ComponentLink2Description: Datasheet; ComponentLink2URL: http://www.panasonic.com/industrial/components/pdf/AOA0000CE3.pdf
  R300 R302: Value: 1K8
  R303 R304: Value: 1R8
R301 = ERAV: as R100 on sheet DE-290817_01; Published: 17-Dec-2003; LatestRevisionDate: 19-Mar-2004; LatestRevisionNote: Silkscreen size reduced.; PackageDocument: Mar-2003; PackageReference: ERA-0603; Publisher: Altium Limited; Code_IPC: 1608 [0603]; ComponentLink1Description: Manufacturer Link; ComponentLink1URL: http://www.panasonic.com/industrial/components/resistive_products.htm; ComponentLink2Description: Datasheet; ComponentLink2URL: http://www.panasonic.com/industrial/components/pdf/AOF0000CE1.pdf; Value: 10K
U300 = MFRC522: MIFARE reader writer
Y300 = ECS-80-20-1: Crystal Oscillator; Published: 17-Jul-2002; DatasheetDocument: 18-Apr-2000; PackageReference: HC-49U; Publisher: Altium Limited; ComponentLink1Description: Manufacturer Link; ComponentLink1URL: http://www.ecsxtal.com/; ComponentLink2Description: Datasheet; ComponentLink2URL: http://www.ecsxtal.com/pdf2/HC49U.PDF

## Nets that join several sheets
+3V3: DE-290817_01 (31 pins), DE-290817_02 (8 pins), DE-290817_03 (C300.2 L300.1)
+5V: DE-290817_01 (D103.2), DE-290817_02 (20 pins)
VSS: DE-290817_01 (49 pins), DE-290817_02 (70 pins), DE-290817_03 (19 pins)
DIN0: DE-290817_01 (U102.18), DE-290817_02 (C201.2 D200.1 R207.2)
DIN1: DE-290817_01 (U102.19), DE-290817_02 (C202.2 D201.1 R208.2)
DIN2: DE-290817_01 (U102.20), DE-290817_02 (C203.2 D202.1 R209.2)
DIN3: DE-290817_01 (U102.39), DE-290817_02 (C204.2 D203.1 R210.2)
DIN4: DE-290817_01 (U102.40), DE-290817_02 (C208.2 D208.1 R212.2)
DIN5: DE-290817_01 (U102.41), DE-290817_02 (C207.2 D207.1 R213.2)
DIN6: DE-290817_01 (U102.42), DE-290817_02 (C206.2 D206.1 R214.2)
DIN7: DE-290817_01 (U102.43), DE-290817_02 (C205.2 D205.1 R215.2)
DOORLOCK_PWM: DE-290817_01 (U102.16), DE-290817_02 (R220.2)
DOUT0: DE-290817_01 (U102.14), DE-290817_02 (Q202.1 R222.2)
DOUT1: DE-290817_01 (U102.15), DE-290817_02 (Q203.1 R223.2)
DOUT2: DE-290817_01 (U102.17), DE-290817_02 (Q205.1 R229.2)
DOUT3: DE-290817_01 (U101.4), DE-290817_02 (Q209.1 R232.2)
DOUT4: DE-290817_01 (U101.5), DE-290817_02 (Q210.1 R233.2)
I2C1_SCL: DE-290817_01 (R112.1 U100.3 U102.45 U103.6), DE-290817_03 (U300.31)
I2C1_SDA: DE-290817_01 (R111.1 U100.2 U102.46 U103.5), DE-290817_03 (U300.24)
ONE_WIRE_RX: DE-290817_01 (U102.13), DE-290817_02 (Q204.3 R226.2)
ONE_WIRE_TX: DE-290817_01 (U102.12), DE-290817_02 (Q208.1 R230.1)
RC522_RST: DE-290817_01 (D107.2), DE-290817_03 (R301.1 U300.6)
RS485_DIR: DE-290817_01 (R117.1 U102.32), DE-290817_02 (U200.2 U200.3)
SOUND_PWM: DE-290817_01 (U102.29), DE-290817_02 (Q200.1 R211.2)
USART1_RX: DE-290817_01 (U102.31), DE-290817_02 (R227.2 R228.1)
USART1_TX: DE-290817_01 (U102.30), DE-290817_02 (U200.4)